# Altium schematic sheet Sheet1.SchDoc
size A
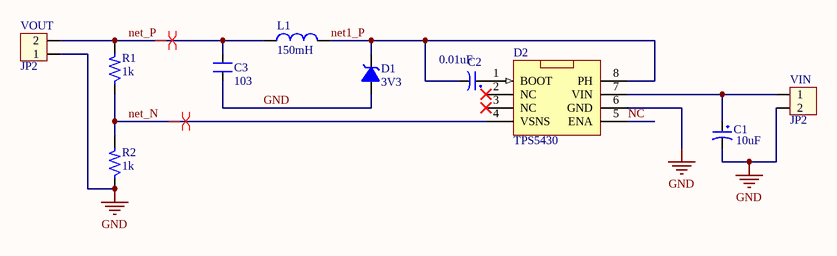
[diagram p0: Sheet1.SchDoc]

## Parts
C1  10uF  [CP1/2.5_SM]
C2  0.01uF  [CP1/470uF]
C3  103  [SM-0805]
D1  3V3  [SM-DIODE]
D2  TPS5430  [TPS5430]
L1  150mH  [L01]
R1  1k  [SM-0805]
R2  1k  [SM-0805]
VIN  JP2  [CON2]
VOUT  JP2  [CON2]

## Nets
GND: C1.2 C3.1 D1.1(A) D2.6(GND) R2.1 VIN.2 VOUT.1
NC: D2.5(ENA)
net1_P: C2.2 D1.2(K) D2.8(PH) L1.2
net_N: D2.4(VSNS) R1.1 R2.2
net_P: C3.2 L1.1 R1.2 VOUT.2
NetC1_1: C1.1 D2.7(VIN) VIN.1
NetC2_1: C2.1 D2.1(BOOT)

Not connected (* = marked no-connect by the designer): D2 2(NC)* 3(NC)*

## Layout directives
differential pair: net_N, net_P

## Library data of the parts
C1 C2 = CP9: Cap 10000uF/63V; Value: 220uF/450V
C3 = CM: Cap SMD; Value: 103
D1 = DZ: Diode Zenner; Value: 3v3
L1 = L1: Inductor; Value: 150 mH
R1 R2 = R: Resistor 1/4W; Value: R1/4W - 1K
VIN VOUT = Con2: Connector 2; Value: Connector 2